# Altium schematic sheet nrf52840_v2.SchDoc
size Tabloid; Revision: 1.0; SheetNumber: 1; SheetTotal: 1; DrawnBy: RUBR; DocumentSize: A4; Device: nRF52840-QFAA; RefLayoutTitle: Reference Layout
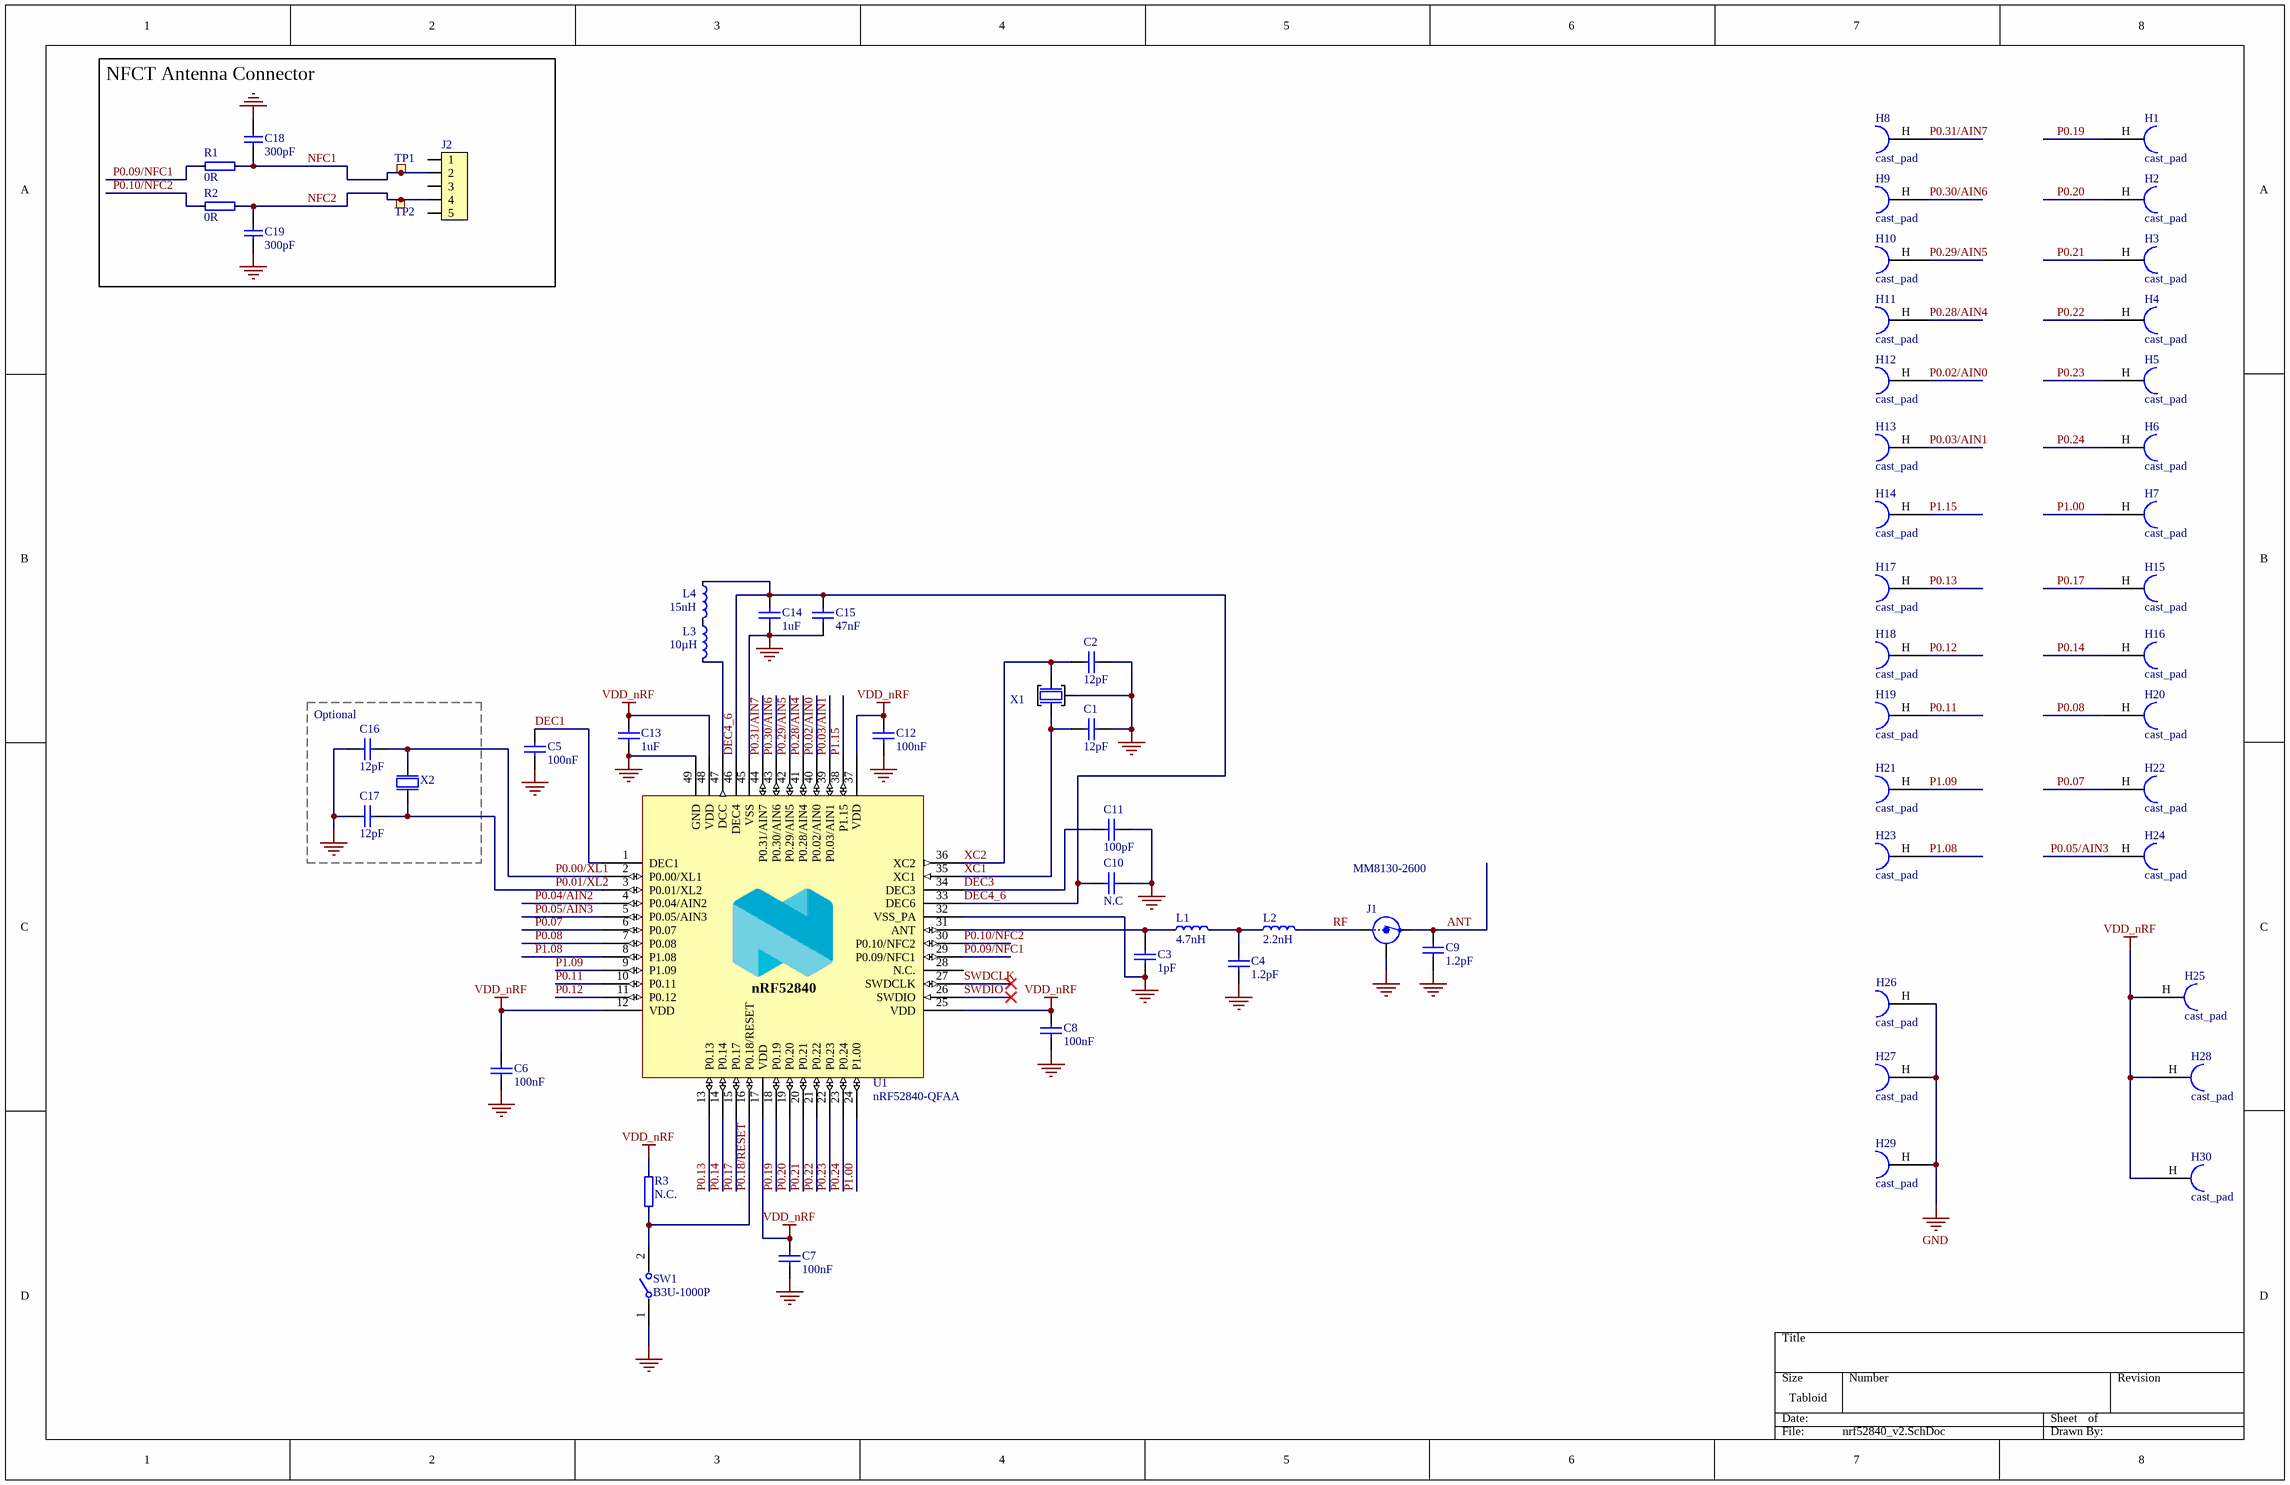
[diagram p0: nrf52840_v2.SchDoc]

## Parts
C1  12pF  [CAPC1005X55X30LL05T10]
C2  12pF  [CAPC1005X55X30LL05T10]
C3  1pF  [CAPC1005X55X30LL05T10]
C4  1.2pF  [CAPC1005X55X30LL05T10]
C5  100nF  [CAPC1005X55X30LL05T10]
C6  100nF  [CAPC1005X55X30LL05T10]
C7  100nF  [CAPC1005X55X30LL05T10]
C8  100nF  [CAPC1005X55X30LL05T10]
C9  1.2pF  [CAPC1005X55X30LL05T10]
C10  N.C  [CAPC1005X55X30LL05T10]
C11  100pF  [CAPC1005X55X30LL05T10]
C12  100nF  [CAPC1005X55X30LL05T10]
C13  1uF  [CAPC1005X55X30LL05T10]
C14  1uF  [CAPC1005X55X30LL05T10]
C15  47nF  [CAPC1005X55X30LL05T10]
C16  12pF  [CAPC1005X55X30LL05T10]
C17  12pF  [CAPC1005X55X30LL05T10]
C18  300pF  [CAPC1005X04L]
C19  300pF  [CAPC1005X04L]
H1  cast_pad  [cast_pad]
H2  cast_pad  [cast_pad]
H3  cast_pad  [cast_pad]
H4  cast_pad  [cast_pad]
H5  cast_pad  [cast_pad]
H6  cast_pad  [cast_pad]
H7  cast_pad  [cast_pad]
H8  cast_pad  [cast_pad]
H9  cast_pad  [cast_pad]
H10  cast_pad  [cast_pad]
H11  cast_pad  [cast_pad]
H12  cast_pad  [cast_pad]
H13  cast_pad  [cast_pad]
H14  cast_pad  [cast_pad]
H15  cast_pad  [cast_pad]
H16  cast_pad  [cast_pad]
H17  cast_pad  [cast_pad]
H18  cast_pad  [cast_pad]
H19  cast_pad  [cast_pad]
H20  cast_pad  [cast_pad]
H21  cast_pad  [cast_pad]
H22  cast_pad  [cast_pad]
H23  cast_pad  [cast_pad]
H24  cast_pad  [cast_pad]
H25  cast_pad  [cast_pad]
H26  cast_pad  [cast_pad]
H27  cast_pad  [cast_pad]
H28  cast_pad  [cast_pad]
H29  cast_pad  [cast_pad]
H30  cast_pad  [cast_pad]
J1  MM8130-2600  [COAXIAL-SWF]
J2  (no value)  [FPC_05P-0.5mm-RA-SMD]
L1  4.7nH  [INDC0603X03L_C]
L2  2.2nH  [INDC0603X03L_C]
L3  10µH  [INDC1608X06L]
L4  15nH  [INDC1005X04L]
R1  0R  [RESC1005X04L]
R2  0R  [RESC1005X04L]
R3  N.C.  [RESC1005X04L]
SW1  B3U-1000P  [FP-B3U-1000P-MFG]
TP1  Ø1.0mm,SMD  [TP_SMD_Ø1.0mm]  (value not drawn)  (no BOM)
TP2  Ø1.0mm,SMD  [TP_SMD_Ø1.0mm]  (value not drawn)  (no BOM)
U1  nRF52840-QFAA  [QFN40P600X600X90-48N]
X1  (no value)  [XTAL_2016_NT]
X2  (no value)  [XTAL_2012]

## Blocks framed on the sheet
NFCT Antenna Connector: C18 C19 J2 R1 R2 TP1 TP2
Optional: C16 C17 X2

## Nets
GND: C1.2 C2.2 C3.1 C4.1 C5.1 C6.1 C7.1 C8.1 C9.1 C10.2 C11.2 C12.1 C13.1 C14.1 C15.1 C16.1 C17.1 C18.2 C19.1 H26.H H27.H H29.H J1.2(Shield) SW1.1 U1.32(VSS_PA) U1.45(VSS) U1.49(GND) X1.2(GND)
VDD_nRF: C6.2 C7.2 C8.2 C12.2 C13.2 H25.H H28.H H30.H R3.2 U1.12(VDD) U1.17(VDD) U1.25(VDD) U1.37(VDD) U1.48(VDD)
ANT: C9.2 J1.3(OUT)
DEC1: C5.2 U1.1(DEC1)
DEC3: C11.1 U1.34(DEC3)
DEC4_6: C10.1 C14.2 C15.2 L4.1 U1.33(DEC6) U1.46(DEC4)
NFC1: C18.1 J2.2 R1.1 TP1.1
NFC2: C19.2 J2.4 R2.1 TP2.1
P0.00/XL1: C16.2 U1.2(P0.00/XL1) X2.1(inp)
P0.01/XL2: C17.2 U1.3(P0.01/XL2) X2.2(out)
P0.02/AIN0: H12.H U1.40(P0.02/AIN0)
P0.03/AIN1: H13.H U1.39(P0.03/AIN1)
P0.04/AIN2: U1.4(P0.04/AIN2)
P0.05/AIN3: H24.H U1.5(P0.05/AIN3)
P0.07: H22.H U1.6(P0.07)
P0.08: H20.H U1.7(P0.08)
P0.09/NFC1: R1.2 U1.29(P0.09/NFC1)
P0.10/NFC2: R2.2 U1.30(P0.10/NFC2)
P0.11: H19.H U1.10(P0.11)
P0.12: H18.H U1.11(P0.12)
P0.13: H17.H U1.13(P0.13)
P0.14: H16.H U1.14(P0.14)
P0.17: H15.H U1.15(P0.17)
P0.18/RESET: R3.1 SW1.2 U1.16(P0.18/RESET)
P0.19: H1.H U1.18(P0.19)
P0.20: H2.H U1.19(P0.20)
P0.21: H3.H U1.20(P0.21)
P0.22: H4.H U1.21(P0.22)
P0.23: H5.H U1.22(P0.23)
P0.24: H6.H U1.23(P0.24)
P0.28/AIN4: H11.H U1.41(P0.28/AIN4)
P0.29/AIN5: H10.H U1.42(P0.29/AIN5)
P0.30/AIN6: H9.H U1.43(P0.30/AIN6)
P0.31/AIN7: H8.H U1.44(P0.31/AIN7)
P1.00: H7.H U1.24(P1.00)
P1.08: H23.H U1.8(P1.08)
P1.09: H21.H U1.9(P1.09)
P1.15: H14.H U1.38(P1.15)
RF: J1.1(IN) L2.2
SWDCLK: U1.27(SWDCLK)
SWDIO: U1.26(SWDIO)
XC1: C1.1 U1.35(XC1) X1.1(IN)
XC2: C2.1 U1.36(XC2) X1.3(OUT)
NetC3_2: C3.2 L1.1 U1.31(ANT)
NetC4_2: C4.2 L1.2 L2.1
NetL3_1: L3.1 L4.2
NetL3_2: L3.2 U1.47(DCC)

Not connected (* = marked no-connect by the designer): J2 1 3 5; U1 28(N.C.)

## Notes on the sheet
- Title
- Size
- Date:
- A4
- Device
- Sheet         of
- Revision
- File:
- Drawn By:
- (in symbol nRF52840-QFAA) nRF52840

## Library data of the parts
C1-C17 = CMP-1034-01886-2: Part Number: C0402C103K5RACTU; Manufacturer: Kemet
C18 C19 = C0402-300p: Capacitor, NP0, ±5%; Manufacturer: N.A.; Part number IPS: 00000007788; Note: 50V; Artikkelnr Noca: 20020004; Pad Count: 2; Part Number: C0402-300p; Manufacturer Part Number: N.A.; Footprint Doc: 0402; LatestRevisionDate: 2020-10-13; Pin Count: 2; Publisher: Nordic Semiconductor; Published: 2015-05-29; Value: 300pF; ComponentLink1URL: N.A.; ComponentLink1Description: Datasheet; ComponentLink2URL: N.A.; ComponentLink2Description: Supplier link; HelpURL: N.A.; Supplier 1: Digi-Key; Supplier Part Number 1: 490-3234-1-ND; Supplier 2: N.A.; Supplier Part Number 2: N.A.; Author: rsk; Component Class: Capacitors; PartId: 100200155; Part number Norautron: N.A.
J1 = MM8130-2600: Coaxial Connector with Switch; Manufacturer: Murata; Part number IPS: 00000009955; Note: N.A.; Artikkelnr Noca: 55029011; Pad Count: 3; Part Number: MM8130-2600; Manufacturer Part Number: MM8130-2600; LatestRevisionDate: 2014-04-24; Pin Count: 3; Publisher: Nordic Semiconductor; Published: 2014-04-24; Value: MM8130-2600; Footprint Doc: COAXIAL-SWF; ComponentLink1URL: N.A.; ComponentLink1Description: Datasheet; ComponentLink2URL: N.A.; ComponentLink2Description: Supplier link; HelpURL: http://www.murata.com/products/catalog/pdf/o33e.pdf; Supplier 1: Digi-Key; Supplier Part Number 1: 490-4981-1-ND; Supplier 2: Mouser; Supplier Part Number 2: 81-MM8130-2600RA2; Author: rsk; Component Class: Connectors; PartId: 100500400; Part number Norautron: N.A.
J2 = FPC_05P-0.5mm-RA-SMD: 0.5mm FPC, 5P,Right Angle SMT,Double Contact,H=1.2mm,White, Tin plated; Manufacturer: W-CON; Manufacturer Part Number: 5141-05RZDNWR01; Part number IPS: 00000007792; Value: FPC 0.5mm RA SMD; Note: N.A.; Artikkelnr Noca: 55010020; Pad Count: 7; Part Number: FPC_05P-0.5mm-RA-SMD; Footprint Doc: FPC_05P-0.5mm-RA-SMD; LatestRevisionDate: 2016-04-21; Pin Count: 7; Publisher: Nordic Semiconductor; Published: 2015-06-22; ComponentLink1URL: N.A.; ComponentLink1Description: Datasheet; ComponentLink2URL: N.A.; ComponentLink2Description: Supplier link; HelpURL: \\hizz\pro\app9717\Datasheet\connectors\W-CON\5141-XXRZDNXX0X.pdf; Supplier 1: Cabcon; Supplier Part Number 1: 5141-05RZDNWR01; Supplier 2: Digi-Key; Supplier Part Number 2: WM9836CT-ND; Author: rsk; Component Class: Connectors; PartId: 100500528; Part number Norautron: N.A.
L1 = L0201-4n7: High frequency chip inductor ±5%; Pad Count: 2; Part Number: L0201-4n7; LatestRevisionDate: 2013-04-10; Published: 2013-04-10; Value: 4.7nH; Footprint Doc: 0201; Component Class: Inductors
L2 = L0201-2n2: High frequency chip inductor ±5%; Pad Count: 2; Part Number: L0201-2n2; LatestRevisionDate: 2013-04-10; Published: 2013-04-10; Value: 2.2nH; Footprint Doc: 0201; Component Class: Inductors
L3 = L0603-10µ-TDK: Chip inductor, IDC,min = 50 mA, ±20%; Pad Count: 2; Part Number: L0603-10µ-TDK; LatestRevisionDate: 2012-09-19; Published: 2019-05-06; Value: 10µH; Footprint Doc: 0603; Component Class: Inductors
L4 = L0402-15n: High frequency chip inductor ±10%; Pad Count: 2; Part Number: L0402-15n; LatestRevisionDate: 2012-09-19; Published: 2010-07-12; Value: 15nH; Footprint Doc: 0402; Component Class: Inductors
R1 R2 = R0402-0R: Resistor, ±5%, 0.063W; Manufacturer: N.A.; Part number IPS: 00000007128; Note: Chip Res 5%; Artikkelnr Noca: 27049000; Pad Count: 2; Part Number: R0402-0R; Manufacturer Part Number: N.A.; Footprint Doc: 0402; LatestRevisionDate: 2009-11-23; Pin Count: 2; Publisher: Nordic Semiconductor; Published: 2009-05-08; Value: 0R; ComponentLink1URL: N.A.; ComponentLink1Description: Datasheet; ComponentLink2URL: N.A.; ComponentLink2Description: Supplier link; HelpURL: N.A.; Supplier 1: Farnell; Supplier Part Number 1: 146-9661; Supplier 2: N.A.; Supplier Part Number 2: N.A.; Author: rsk; Component Class: Resistors; PartId: 100100109; Part number Norautron: N.A.
R3 = R0402-N.C.: Not mounted; Manufacturer: N.A.; Note: Chip Res; Assembly: Not mounted; Pad Count: 2; Part Number: R0402-N.C.; Manufacturer Part Number: N.A.; Footprint Doc: 0402; LatestRevisionDate: 2009-05-08; Pin Count: 2; Publisher: Nordic Semiconductor; Published: 2009-05-08; Value: N.C.; Artikkelnr Noca: N.A.; Part number IPS: N.A.; ComponentLink1URL: N.A.; ComponentLink1Description: Datasheet; ComponentLink2URL: N.A.; ComponentLink2Description: Supplier link; HelpURL: N.A.; Supplier 1: N.A.; Supplier Part Number 1: N.A.; Supplier 2: N.A.; Supplier Part Number 2: N.A.; Author: rsk; Component Class: Resistors; PartId: 100100281; Part number Norautron: N.A.
SW1 = CMP-2100-03586-2: SWITCH TACTILE SPST-NO 0.05A 12V; Contact Resistance: 100mR; Operating Force: 1.5N; Max Current Rating: 50mA; Switch Travel: 0.15mm; Actuator Type: Standard; Mechanical Life: 200000Cycles; Ratings: Dust Proof; Illumination Type: Non-Illuminated; Throw Configuration: SPST; Actuator Length: 0.4mm; Switch Function: Off-Mom; Height: 1.2mm; Width: 3mm; Weight: 0.000776oz; Contact Material: Silver; Max Voltage Rating (DC): 12V; Insulation Resistance: 100MR; Lead Free: Lead Free; Current Rating: 50mA; Termination: SMD/SMT; Length: 4mm; Voltage Rating (DC): 12V; Contact Current Rating: 50mA; Orientation: Straight; Depth: 2.5mm; Max Operating Temperature: 70°C; Packaging: Tape and Reel; Min Operating Temperature: -25°C; Package Quantity: 1; Mount: Surface Mount; Electrical Life: 200000Cycles
TP1 TP2 = TP_SMD_Ø1.0MM: 1.0mm circular SMD testpad; Manufacturer: Nordic Semiconductor; Manufacturer Part Number: N.A.; Pad Count: 1; Part Number: TP_SMD_Ø1.0MM; LatestRevisionDate: 2021-03-05; Pin Count: 1; Publisher: Nordic Semiconductor; Published: 2013-06-11; Value: Ø1.0mm,SMD; Note: N.A.; Artikkelnr Noca: N.A.; Footprint Doc: TP_SMD_Ø1.0mm; Part number IPS: N.A.; ComponentLink1URL: N.A.; ComponentLink1Description: Datasheet; ComponentLink2URL: N.A.; ComponentLink2Description: Supplier link; HelpURL: N.A.; Supplier 1: N.A.; Supplier Part Number 1: N.A.; Supplier 2: N.A.; Supplier Part Number 2: N.A.; Author: rsk; Component Class: Connectors; PartId: 100500475; Part number Norautron: N.A.
U1 = nRF52840-QFAA: Multi-protocol Bluetooth Low Energy, IEEE 802.15.4, ANT and 2.4GHz proprietary system-on-chip; Pad Count: 48; Part Number: nRF52840-QFAA; LatestRevisionDate: 2016-11-22; Published: 2016-03-31; Value: nRF52840-QFAA; Footprint Doc: QFN-48; Component Class: nRF_Devices
X1 = XTAL_SMD2016_32MHz_8pF_General_NT: XTAL SMD 2016, 32MHz, Cl=8pF, Total Tol: ±30ppm; Pad Count: 4; Part Number: XTAL_SMD2016_32MHz_8pF_General_NT; LatestRevisionDate: 2021-04-08; Published: 2021-04-08; Value: 32MHz; Footprint Doc: XTAL_2016; Component Class: Oscillators
X2 = XTAL_SMD2012_32.768kHz_9pF_General: XTAL SMD 2012, 32.768kHz, Cl=9pF, Total Tol: ±50ppm; Pad Count: 2; Part Number: XTAL_SMD2012_32.768kHz_9pF_General; LatestRevisionDate: 2017-01-11; Published: 2016-08-19; Value: 32.768kHz; Footprint Doc: XTAL_2012; Component Class: Oscillators